# EasyEDA schematic luxer.json
TITLE: Sheet_1; REV: 1.0; Date: 2020-01-29; Sheet: 1/1; Drawn By: Nikola; Company: Your Company
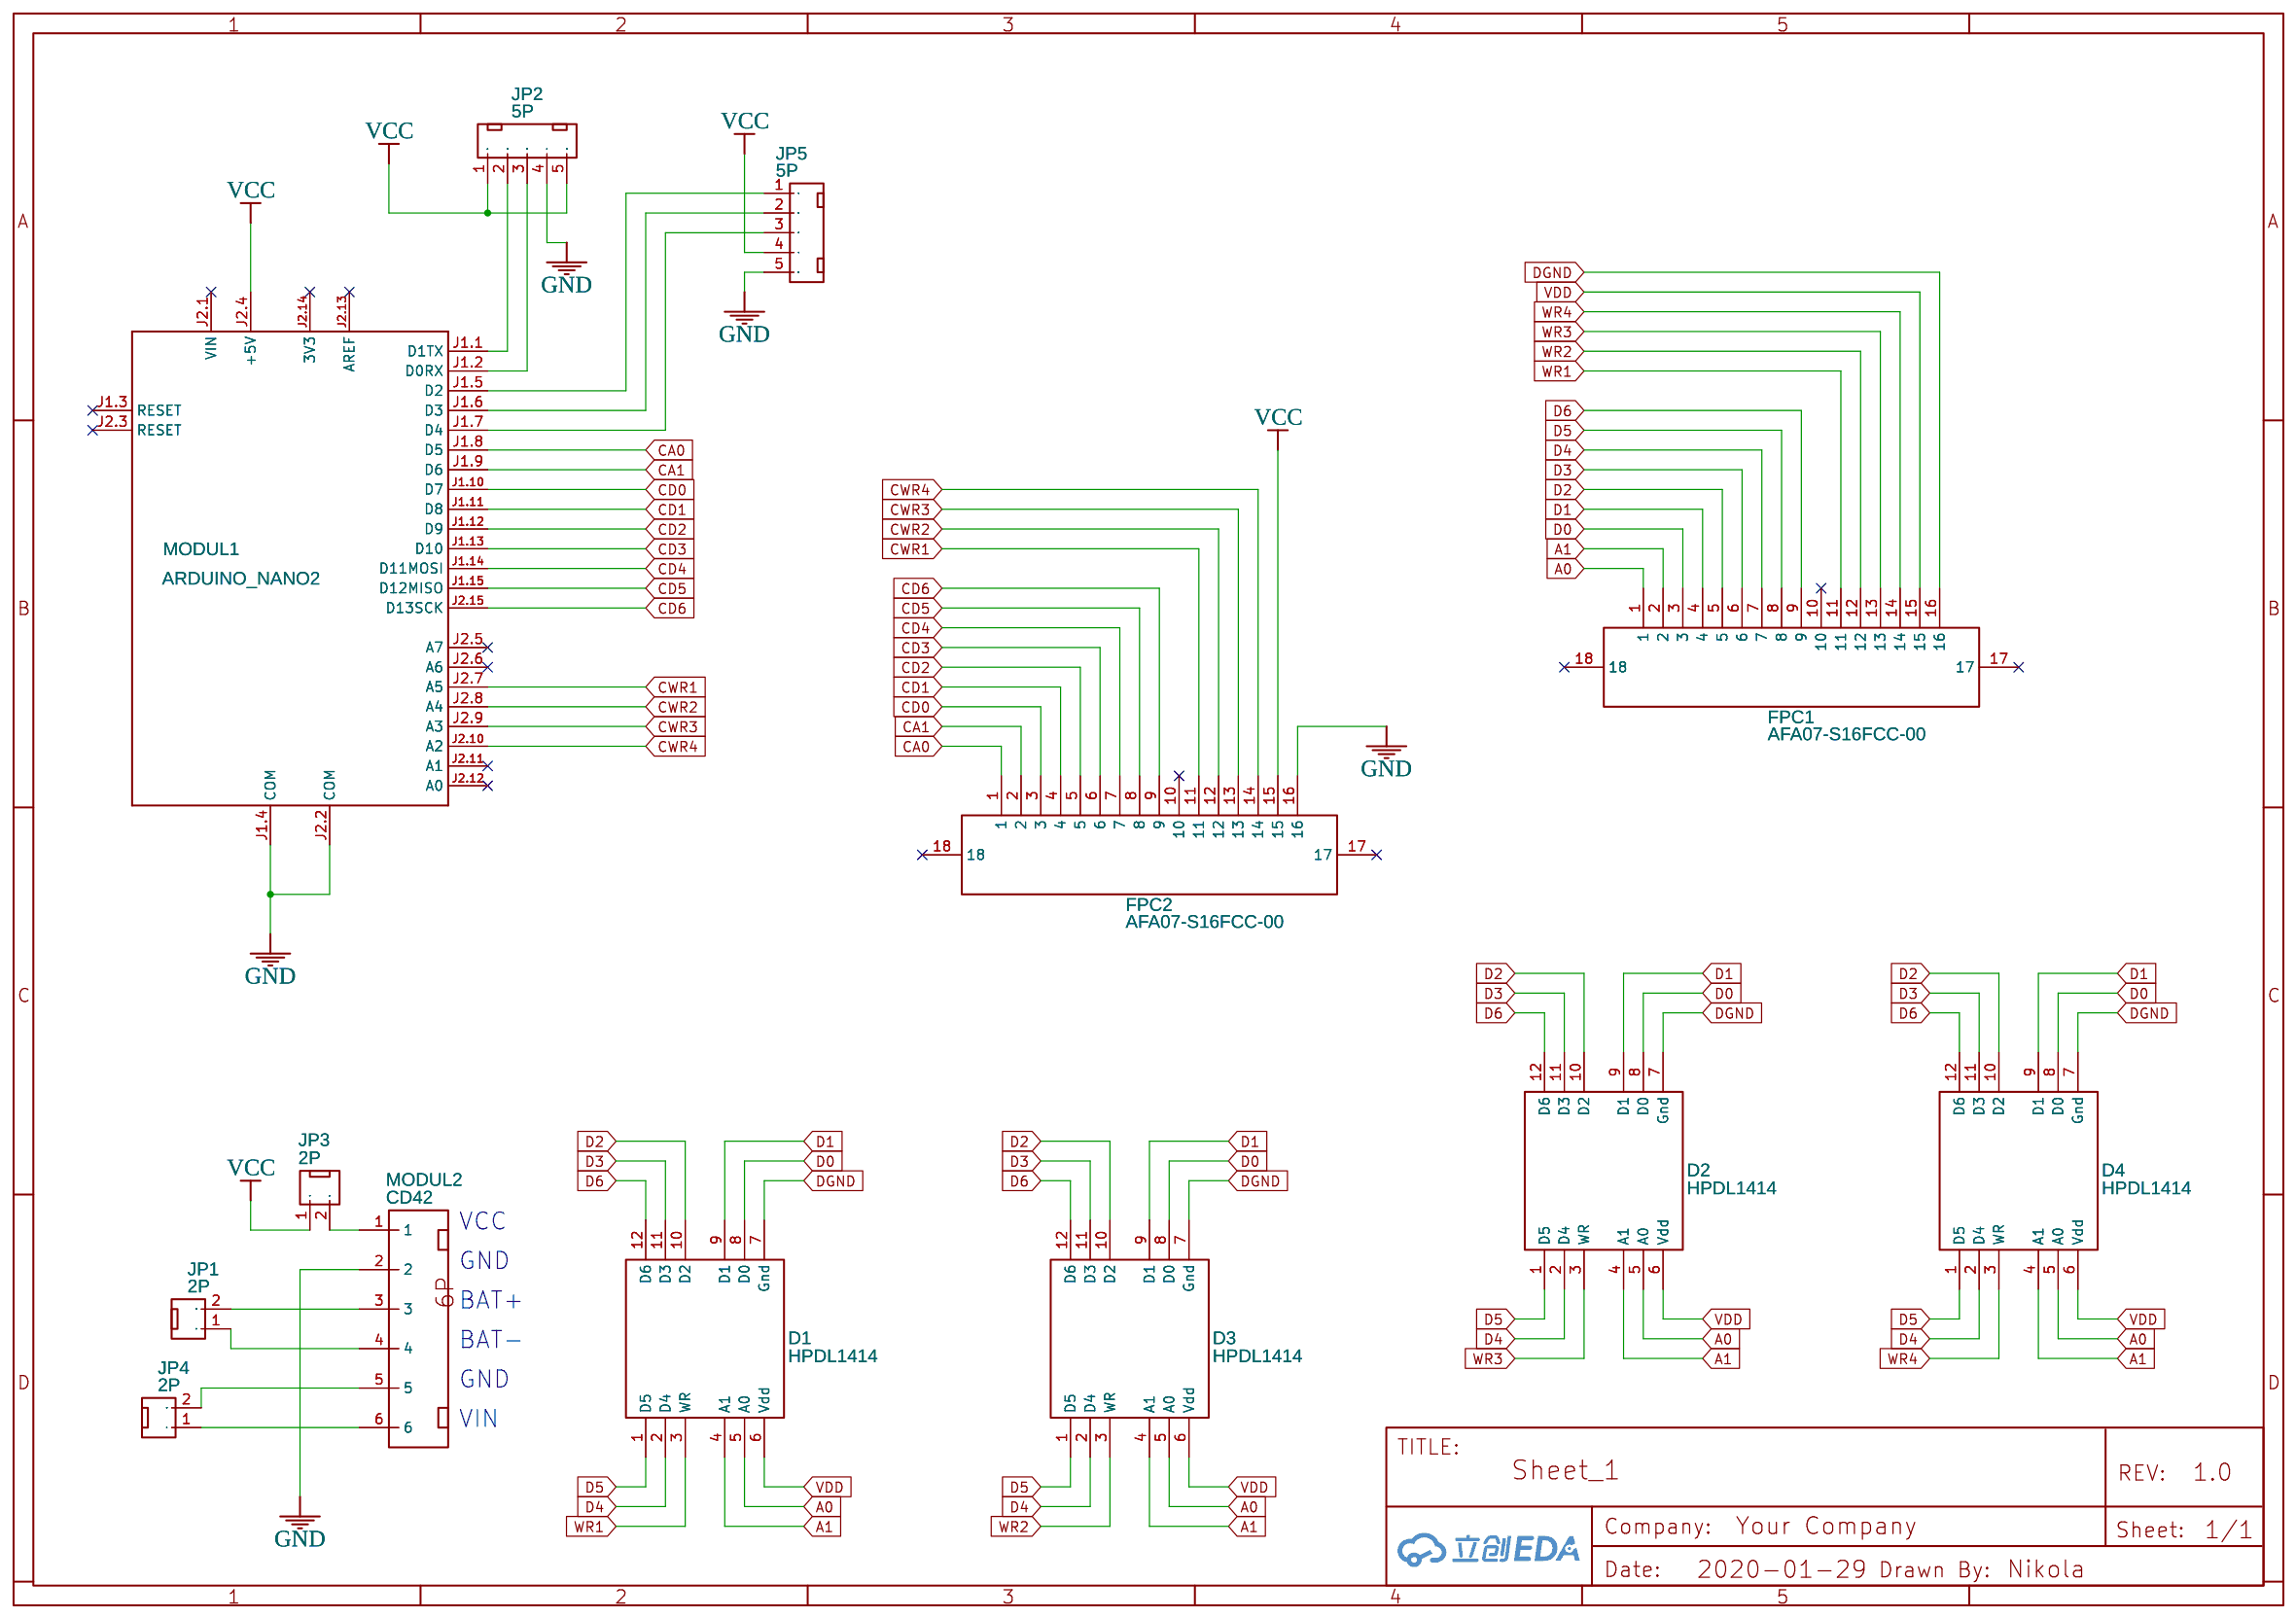
[diagram p0: schematic sheet]

## Parts
D1  HPDL1414  [HPDL1414]
D2  HPDL1414  [HPDL1414]
D3  HPDL1414  [HPDL1414]
D4  HPDL1414  [HPDL1414]
FPC1  AFA07-S16FCC-00  [FPC-SMD_16P-P1.00_AFA07-S16FCC-00]
FPC2  AFA07-S16FCC-00  [FPC-SMD_16P-P1.00_AFA07-S16FCC-00]
JP1  2P  [XH2.54-2P]
JP2  5P  [XH2.54-5P]
JP3  2P  [XH2.54-2P]
JP4  2P  [XH2.54-2P]
JP5  5P  [XH2.54-5P]
MODUL1  ARDUINO_NANO2  [ARDUINO_NANO2]
MODUL2  CD42  [CD42-SMD]

## Library data of the parts
D1-D4 = HPDL1414: Contributor: Wenkai
FPC1 FPC2 = AFA07-S16FCC-00: Supplier: LCSC; Supplier Part: C13744; Manufacturer: JUSHUO; Contributor: LCSC
JP1 JP3 JP4 = 2P: Supplier Part: undefined; Contributor: lzz495
JP2 JP5 = 5P: Supplier Part: undefined; Contributor: lzz495
MODUL1 = ARDUINO_NANO2
MODUL2 = 6P: Supplier Part: undefined; Contributor: Guest

## Nets
DGND: D1.7(Gnd) D2.7(Gnd) D3.7(Gnd) D4.7(Gnd) FPC1.16
GND: FPC2.16 JP2.4 JP5.5 MODUL1.J1.4(COM) MODUL1.J2.2(COM) MODUL2.2
VCC: FPC2.15 JP2.1 JP2.5 JP3.1 JP5.4 MODUL1.J2.4(+5V)
VDD: D1.6(Vdd) D2.6(Vdd) D3.6(Vdd) D4.6(Vdd) FPC1.15
A0: D1.5(A0) D2.5(A0) D3.5(A0) D4.5(A0) FPC1.1
A1: D1.4(A1) D2.4(A1) D3.4(A1) D4.4(A1) FPC1.2
CA0: FPC2.1 MODUL1.J1.8(D5)
CA1: FPC2.2 MODUL1.J1.9(D6)
CD0: FPC2.3 MODUL1.J1.10(D7)
CD1: FPC2.4 MODUL1.J1.11(D8)
CD2: FPC2.5 MODUL1.J1.12(D9)
CD3: FPC2.6 MODUL1.J1.13(D10)
CD4: FPC2.7 MODUL1.J1.14(D11MOSI)
CD5: FPC2.8 MODUL1.J1.15(D12MISO)
CD6: FPC2.9 MODUL1.J2.15(D13SCK)
CWR1: FPC2.11 MODUL1.J2.7(A5)
CWR2: FPC2.12 MODUL1.J2.8(A4)
CWR3: FPC2.13 MODUL1.J2.9(A3)
CWR4: FPC2.14 MODUL1.J2.10(A2)
D0: D1.8(D0) D2.8(D0) D3.8(D0) D4.8(D0) FPC1.3
D1: D1.9(D1) D2.9(D1) D3.9(D1) D4.9(D1) FPC1.4
D2: D1.10(D2) D2.10(D2) D3.10(D2) D4.10(D2) FPC1.5
D3: D1.11(D3) D2.11(D3) D3.11(D3) D4.11(D3) FPC1.6
D4: D1.2(D4) D2.2(D4) D3.2(D4) D4.2(D4) FPC1.7
D5: D1.1(D5) D2.1(D5) D3.1(D5) D4.1(D5) FPC1.8
D6: D1.12(D6) D2.12(D6) D3.12(D6) D4.12(D6) FPC1.9
WR1: D1.3(WR) FPC1.11
WR2: D3.3(WR) FPC1.12
WR3: D2.3(WR) FPC1.13
WR4: D4.3(WR) FPC1.14
Net-(JP1-1): JP1.1 MODUL2.4
Net-(JP1-2): JP1.2 MODUL2.3
Net-(JP2-2): JP2.2 MODUL1.J1.1(D1TX)
Net-(JP2-3): JP2.3 MODUL1.J1.2(D0RX)
Net-(JP3-2): JP3.2 MODUL2.1
Net-(JP4-1): JP4.1 MODUL2.6
Net-(JP4-2): JP4.2 MODUL2.5
Net-(JP5-1): JP5.1 MODUL1.J1.5(D2)
Net-(JP5-2): JP5.2 MODUL1.J1.6(D3)
Net-(JP5-3): JP5.3 MODUL1.J1.7(D4)

Not connected (* = marked no-connect by the designer): FPC1 10* 17* 18*; FPC2 10* 17* 18*; MODUL1 J1.3(RESET)* J2.1(VIN)* J2.3(RESET)* J2.5(A7)* J2.6(A6)* J2.11(A1)* J2.12(A0)* J2.13(AREF)* J2.14(3V3)*

## Notes on the sheet
- VCC
- GND
- BAT+
- BAT-
- GND
- VIN
